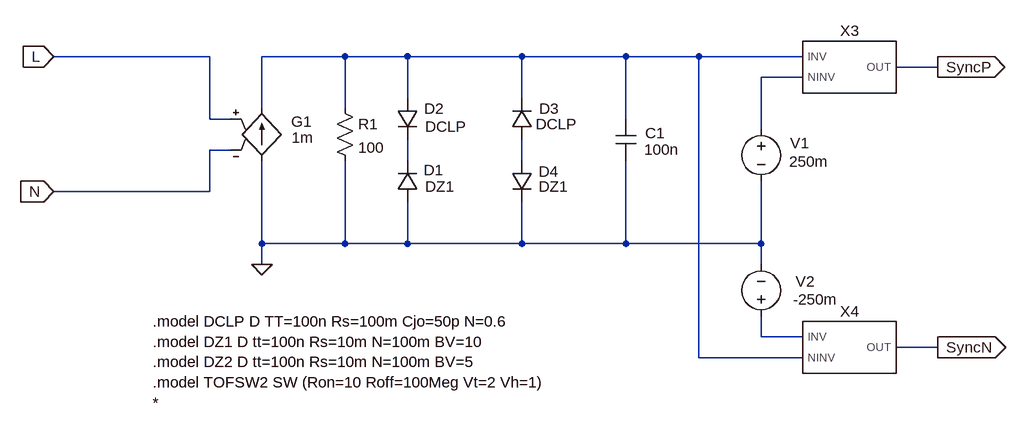
[diagram p0: schematic ACsense.asc]
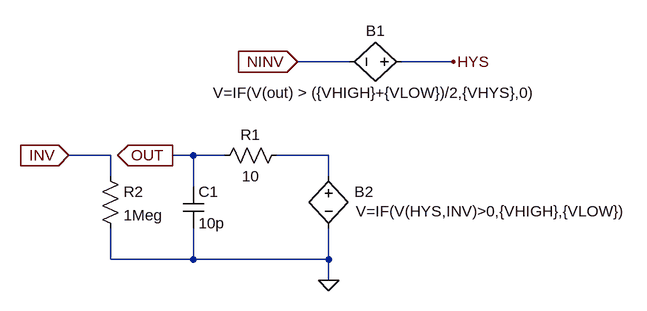
[diagram p1: sub-circuit ompamp.asc]
ACsense.asc, the LTspice schematic file:
Version 4
SHEET 1 1080 680
WIRE -224 32 -464 32
WIRE -16 32 -144 32
WIRE 80 32 -16 32
WIRE 256 32 80 32
WIRE 416 32 256 32
WIRE 528 32 416 32
WIRE 688 32 528 32
WIRE 896 48 832 48
WIRE 688 64 624 64
WIRE 80 96 80 32
WIRE 256 96 256 32
WIRE -144 112 -144 32
WIRE -16 112 -16 32
WIRE -224 128 -224 32
WIRE -192 128 -224 128
WIRE 416 128 416 32
WIRE 624 144 624 64
WIRE -192 176 -224 176
WIRE 80 192 80 160
WIRE 256 192 256 160
WIRE -224 240 -224 176
WIRE -224 240 -464 240
WIRE -144 320 -144 192
WIRE -16 320 -16 192
WIRE -16 320 -144 320
WIRE 80 320 80 256
WIRE 80 320 -16 320
WIRE 256 320 256 256
WIRE 256 320 80 320
WIRE 416 320 416 192
WIRE 416 320 256 320
WIRE 624 320 624 224
WIRE 624 320 416 320
WIRE -144 352 -144 320
WIRE 624 352 624 320
WIRE 624 464 624 432
WIRE 688 464 624 464
WIRE 896 480 832 480
WIRE 528 496 528 32
WIRE 688 496 528 496
FLAG -144 352 0
FLAG -464 32 L
IOPIN -464 32 In
FLAG -464 240 N
IOPIN -464 240 In
FLAG 896 48 SyncP
IOPIN 896 48 Out
FLAG 896 480 SyncN
IOPIN 896 480 Out
SYMBOL g -144 96 R0
WINDOW 0 45 36 Left 2
WINDOW 3 46 61 Left 2
SYMATTR InstName G1
SYMATTR Value 1m
SYMBOL res -32 96 R0
SYMATTR InstName R1
SYMATTR Value 100
SYMBOL diode 96 256 R180
WINDOW 0 -40 49 Left 2
WINDOW 3 -57 24 Left 2
SYMATTR InstName D1
SYMATTR Value DZ1
SYMBOL cap 400 128 R0
WINDOW 0 46 22 Left 2
WINDOW 3 44 47 Left 2
SYMATTR InstName C1
SYMATTR Value 100n
SYMBOL voltage 624 128 R0
WINDOW 0 45 37 Left 2
WINDOW 3 43 66 Left 2
SYMATTR InstName V1
SYMATTR Value 250m
SYMBOL voltage 624 448 M180
WINDOW 0 53 70 Left 2
WINDOW 3 49 42 Left 2
SYMATTR InstName V2
SYMATTR Value -250m
SYMBOL diode 64 96 R0
WINDOW 0 42 16 Left 2
WINDOW 3 43 44 Left 2
SYMATTR InstName D2
SYMATTR Value DCLP
SYMBOL diode 272 160 R180
WINDOW 0 -41 48 Left 2
WINDOW 3 -69 24 Left 2
SYMATTR InstName D3
SYMATTR Value DCLP
SYMBOL diode 240 192 R0
WINDOW 0 42 17 Left 2
WINDOW 3 42 40 Left 2
SYMATTR InstName D4
SYMATTR Value DZ1
SYMBOL Ompamp 752 48 R0
SYMATTR InstName X3
SYMATTR SpiceLine VHIGH=5 VLOW=100m VHYS=10m
SYMBOL Ompamp 752 480 R0
SYMATTR InstName X4
SYMATTR SpiceLine VHIGH=5 VLOW=100m VHYS=10m
TEXT -312 440 Left 2 !.model DCLP D TT=100n Rs=100m Cjo=50p N=0.6\n.model DZ1 D tt=100n Rs=10m N=100m BV=10\n.model DZ2 D tt=100n Rs=10m N=100m BV=5\n.model TOFSW2 SW (Ron=10 Roff=100Meg Vt=2 Vh=1)\n*

ompamp.asc, the sub-circuit schematic file:
Version 4
SHEET 1 1152 680
WIRE 672 -144 592 -144
WIRE 832 -144 752 -144
WIRE 304 0 240 0
WIRE 432 0 400 0
WIRE 480 0 432 0
WIRE 640 0 560 0
WIRE 304 32 304 0
WIRE 640 32 640 0
WIRE 432 48 432 0
WIRE 304 160 304 112
WIRE 432 160 432 112
WIRE 432 160 304 160
WIRE 640 160 640 112
WIRE 640 160 432 160
WIRE 640 192 640 160
FLAG 592 -144 NINV
IOPIN 592 -144 In
FLAG 832 -144 HYS
FLAG 640 192 0
FLAG 400 0 OUT
IOPIN 400 0 Out
FLAG 240 0 INV
IOPIN 240 0 In
SYMBOL bv 768 -144 R90
WINDOW 0 -32 56 VBottom 2
WINDOW 3 32 56 VTop 2
SYMATTR InstName B1
SYMATTR Value V=IF(V(out) > ({VHIGH}+{VLOW})/2,{VHYS},0)
SYMBOL bv 640 16 R0
WINDOW 0 40 40 Left 2
WINDOW 3 42 70 Left 2
SYMATTR InstName B2
SYMATTR Value V=IF(V(HYS,INV)>0,{VHIGH},{VLOW})
SYMBOL res 576 -16 R90
WINDOW 0 0 56 VBottom 2
WINDOW 3 32 56 VTop 2
SYMATTR InstName R1
SYMATTR Value 10
SYMBOL cap 416 48 R0
SYMATTR InstName C1
SYMATTR Value 10p
SYMBOL res 288 16 R0
SYMATTR InstName R2
SYMATTR Value 1Meg

The netlist it stands for:
* ACsense.asc
G1 0 N001 L N 1m
R1 N001 0 100
D1 0 N003 DZ1
C1 N001 0 100n
V1 N002 0 250m
V2 N005 0 -250m
D2 N001 N003 DCLP
D3 N004 N001 DCLP
D4 N004 0 DZ1
XX3 N001 N002 SyncP ompamp params: VHIGH=5 VLOW=100m VHYS=10m
XX4 N005 N001 SyncN ompamp params: VHIGH=5 VLOW=100m VHYS=10m

* block symbol definitions
.subckt ompamp INV NINV OUT
B1 HYS NINV V=IF(V(out) > ({VHIGH}+{VLOW})/2,{VHYS},0)
B2 N001 0 V=IF(V(HYS,INV)>0,{VHIGH},{VLOW})
R1 N001 OUT 10
C1 OUT 0 10p
R2 INV 0 1Meg
.ends ompamp

.model D D
.lib standard.dio
.model DCLP D TT=100n Rs=100m Cjo=50p N=0.6
.model DZ1 D tt=100n Rs=10m N=100m BV=10
.model DZ2 D tt=100n Rs=10m N=100m BV=5
.model TOFSW2 SW (Ron=10 Roff=100Meg Vt=2 Vh=1)
*
.backanno
.end